# Altium schematic sheet S7CAS-PLEIADES-CARTE-MERE_P20_FPGA-Decoupling.SchDoc
size Tabloid; SheetNumber: 11; SheetTotal: 20; Sheet_Name: FPGA Decoupling; Size: 11x17
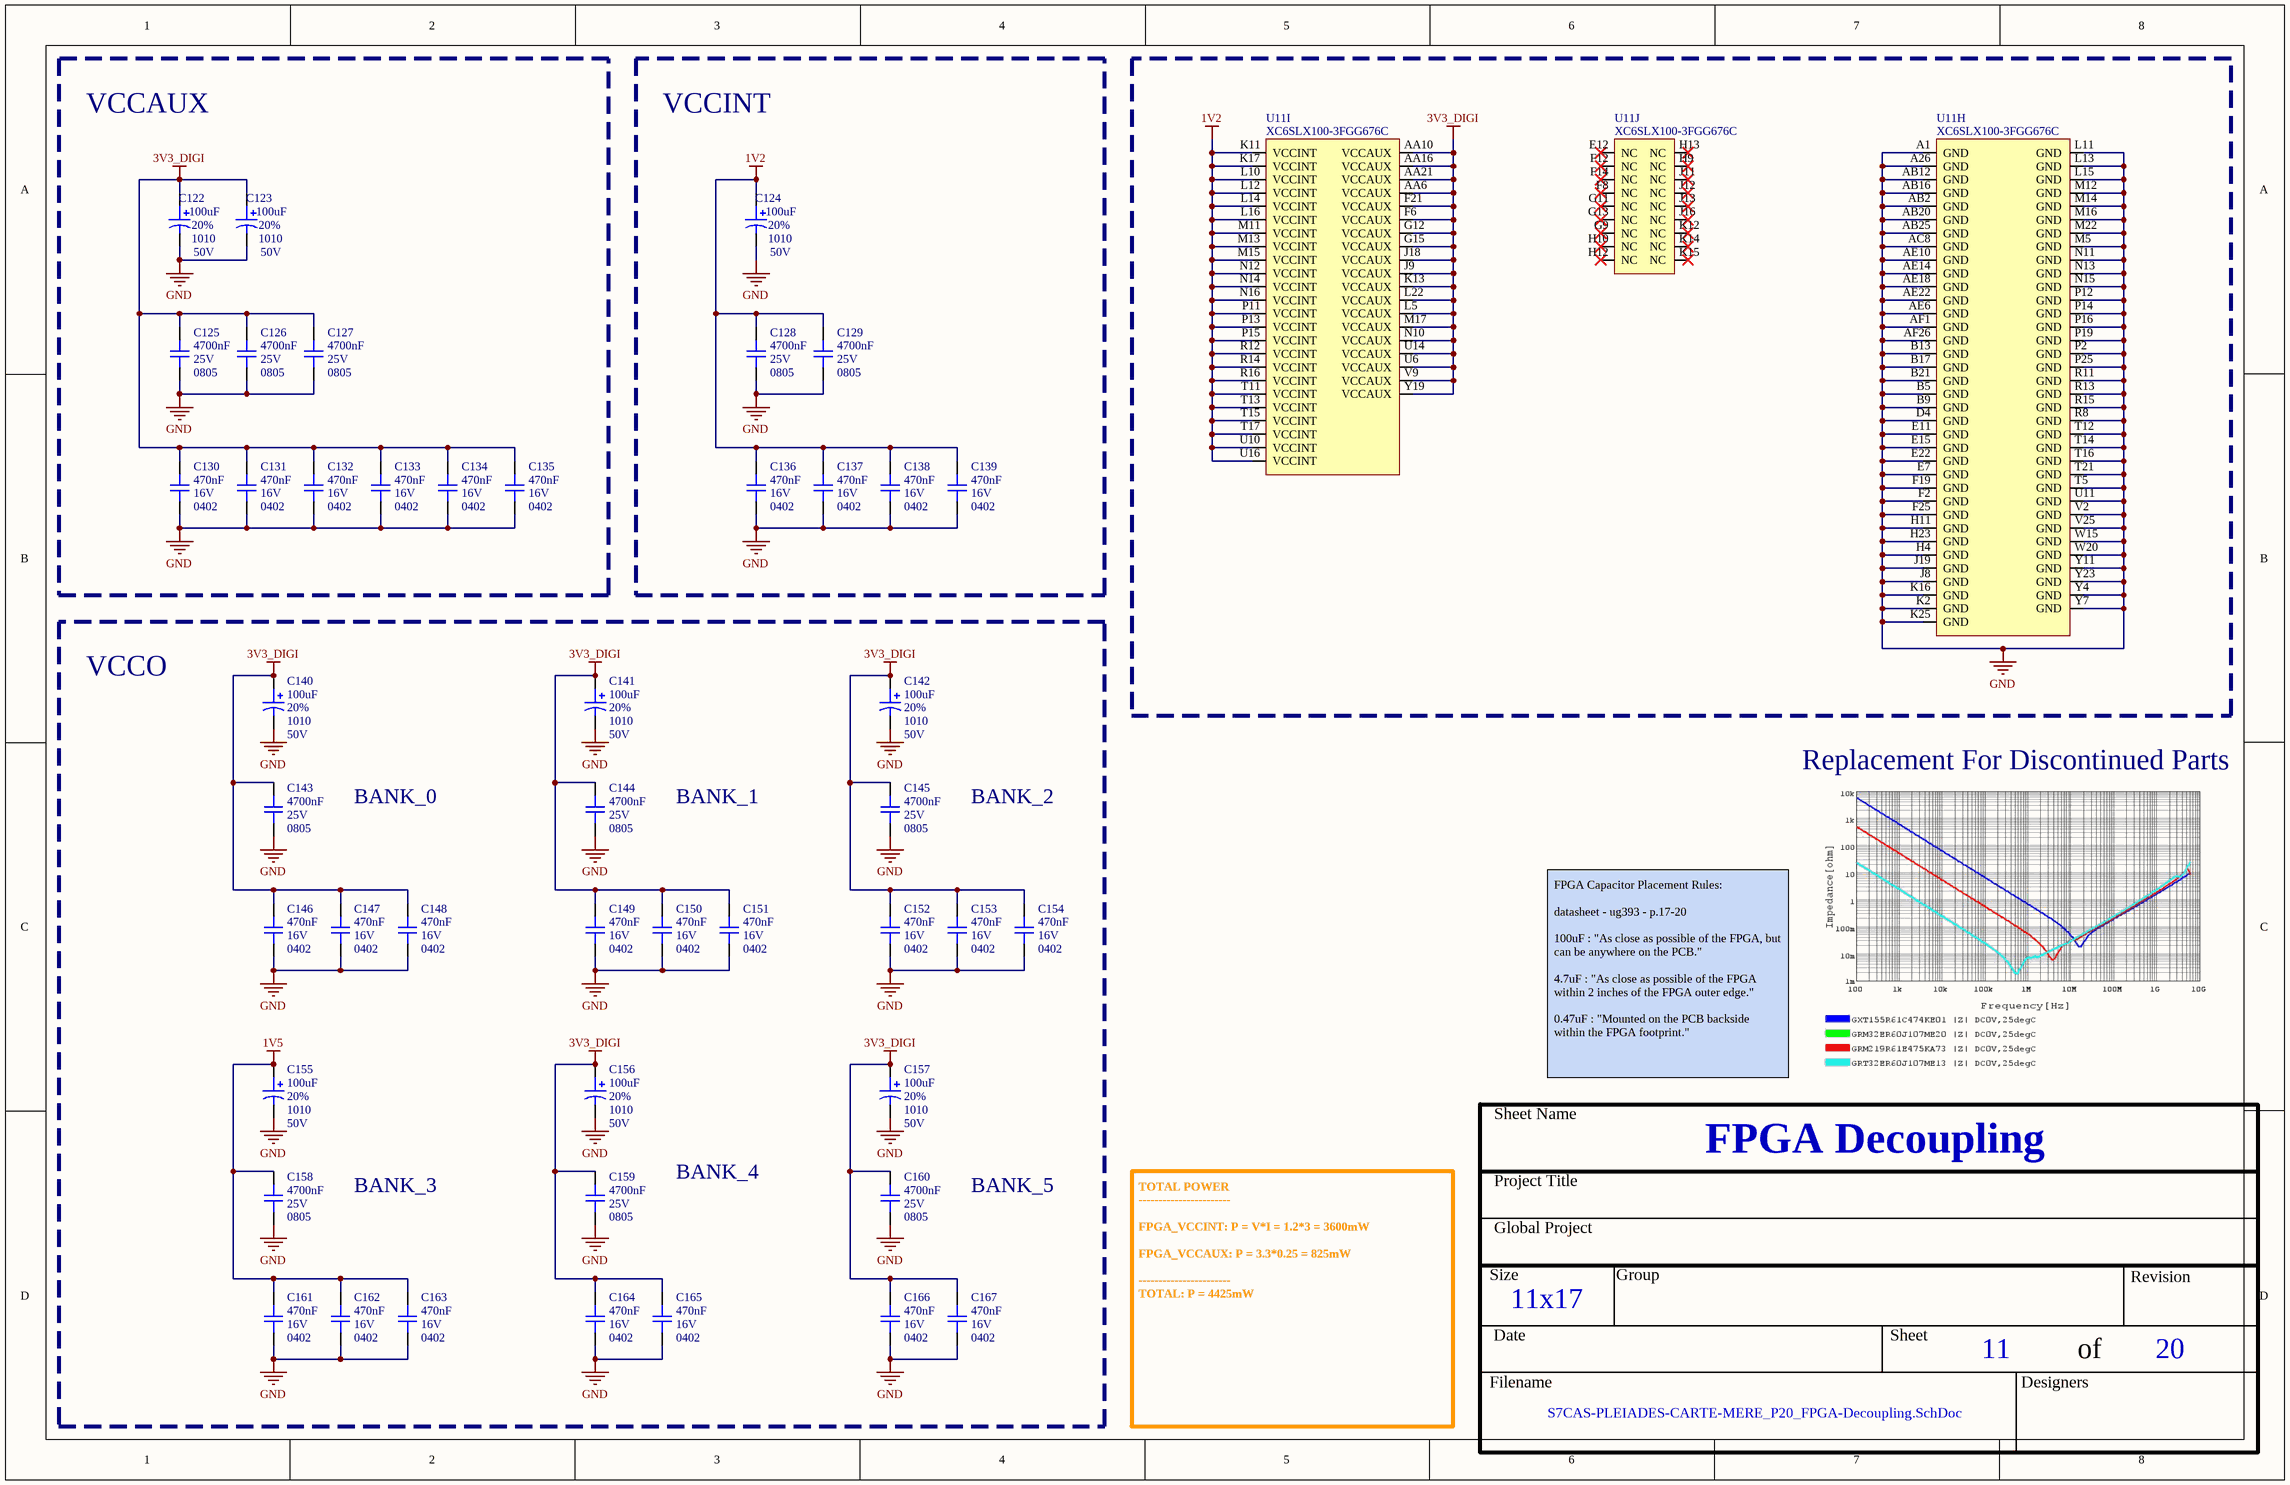
[diagram p0: S7CAS-PLEIADES-CARTE-MERE_P20_FPGA-Decoupling.SchDoc]

## Parts
C122  value 100uF  Voltage: 50V  Package: 1010  Precision: 20%  [CAP_ALU_1010_vishay]  (hidden comment: MAL215099101E3)
C123  value 100uF  Voltage: 50V  Package: 1010  Precision: 20%  [CAP_ALU_1010_vishay]  (hidden comment: MAL215099101E3)
C124  value 100uF  Voltage: 50V  Package: 1010  Precision: 20%  [CAP_ALU_1010_vishay]  (hidden comment: MAL215099101E3)
C125  value 4700nF  Voltage: 25V  Package: 0805  [CAP_0805]  (hidden comment: CAP - 0805)
C126  value 4700nF  Voltage: 25V  Package: 0805  [CAP_0805]  (hidden comment: CAP - 0805)
C127  value 4700nF  Voltage: 25V  Package: 0805  [CAP_0805]  (hidden comment: CAP - 0805)
C128  value 4700nF  Voltage: 25V  Package: 0805  [CAP_0805]  (hidden comment: CAP - 0805)
C129  value 4700nF  Voltage: 25V  Package: 0805  [CAP_0805]  (hidden comment: CAP - 0805)
C130  value 470nF  Voltage: 16V  Package: 0402  [CAP_0402]  (hidden comment: CAP - 0402)
C131  value 470nF  Voltage: 16V  Package: 0402  [CAP_0402]  (hidden comment: CAP - 0402)
C132  value 470nF  Voltage: 16V  Package: 0402  [CAP_0402]  (hidden comment: CAP - 0402)
C133  value 470nF  Voltage: 16V  Package: 0402  [CAP_0402]  (hidden comment: CAP - 0402)
C134  value 470nF  Voltage: 16V  Package: 0402  [CAP_0402]  (hidden comment: CAP - 0402)
C135  value 470nF  Voltage: 16V  Package: 0402  [CAP_0402]  (hidden comment: CAP - 0402)
C136  value 470nF  Voltage: 16V  Package: 0402  [CAP_0402]  (hidden comment: CAP - 0402)
C137  value 470nF  Voltage: 16V  Package: 0402  [CAP_0402]  (hidden comment: CAP - 0402)
C138  value 470nF  Voltage: 16V  Package: 0402  [CAP_0402]  (hidden comment: CAP - 0402)
C139  value 470nF  Voltage: 16V  Package: 0402  [CAP_0402]  (hidden comment: CAP - 0402)
C140  value 100uF  Voltage: 50V  Package: 1010  Precision: 20%  [CAP_ALU_1010_vishay]  (hidden comment: MAL215099101E3)
C141  value 100uF  Voltage: 50V  Package: 1010  Precision: 20%  [CAP_ALU_1010_vishay]  (hidden comment: MAL215099101E3)
C142  value 100uF  Voltage: 50V  Package: 1010  Precision: 20%  [CAP_ALU_1010_vishay]  (hidden comment: MAL215099101E3)
C143  value 4700nF  Voltage: 25V  Package: 0805  [CAP_0805]  (hidden comment: CAP - 0805)
C144  value 4700nF  Voltage: 25V  Package: 0805  [CAP_0805]  (hidden comment: CAP - 0805)
C145  value 4700nF  Voltage: 25V  Package: 0805  [CAP_0805]  (hidden comment: CAP - 0805)
C146  value 470nF  Voltage: 16V  Package: 0402  [CAP_0402]  (hidden comment: CAP - 0402)
C147  value 470nF  Voltage: 16V  Package: 0402  [CAP_0402]  (hidden comment: CAP - 0402)
C148  value 470nF  Voltage: 16V  Package: 0402  [CAP_0402]  (hidden comment: CAP - 0402)
C149  value 470nF  Voltage: 16V  Package: 0402  [CAP_0402]  (hidden comment: CAP - 0402)
C150  value 470nF  Voltage: 16V  Package: 0402  [CAP_0402]  (hidden comment: CAP - 0402)
C151  value 470nF  Voltage: 16V  Package: 0402  [CAP_0402]  (hidden comment: CAP - 0402)
C152  value 470nF  Voltage: 16V  Package: 0402  [CAP_0402]  (hidden comment: CAP - 0402)
C153  value 470nF  Voltage: 16V  Package: 0402  [CAP_0402]  (hidden comment: CAP - 0402)
C154  value 470nF  Voltage: 16V  Package: 0402  [CAP_0402]  (hidden comment: CAP - 0402)
C155  value 100uF  Voltage: 50V  Package: 1010  Precision: 20%  [CAP_ALU_1010_vishay]  (hidden comment: MAL215099101E3)
C156  value 100uF  Voltage: 50V  Package: 1010  Precision: 20%  [CAP_ALU_1010_vishay]  (hidden comment: MAL215099101E3)
C157  value 100uF  Voltage: 50V  Package: 1010  Precision: 20%  [CAP_ALU_1010_vishay]  (hidden comment: MAL215099101E3)
C158  value 4700nF  Voltage: 25V  Package: 0805  [CAP_0805]  (hidden comment: CAP - 0805)
C159  value 4700nF  Voltage: 25V  Package: 0805  [CAP_0805]  (hidden comment: CAP - 0805)
C160  value 4700nF  Voltage: 25V  Package: 0805  [CAP_0805]  (hidden comment: CAP - 0805)
C161  value 470nF  Voltage: 16V  Package: 0402  [CAP_0402]  (hidden comment: CAP - 0402)
C162  value 470nF  Voltage: 16V  Package: 0402  [CAP_0402]  (hidden comment: CAP - 0402)
C163  value 470nF  Voltage: 16V  Package: 0402  [CAP_0402]  (hidden comment: CAP - 0402)
C164  value 470nF  Voltage: 16V  Package: 0402  [CAP_0402]  (hidden comment: CAP - 0402)
C165  value 470nF  Voltage: 16V  Package: 0402  [CAP_0402]  (hidden comment: CAP - 0402)
C166  value 470nF  Voltage: 16V  Package: 0402  [CAP_0402]  (hidden comment: CAP - 0402)
C167  value 470nF  Voltage: 16V  Package: 0402  [CAP_0402]  (hidden comment: CAP - 0402)
U11  XC6SLX100-3FGG676C  [FPGA_XILINX_FGG676]  (parts H,I,J of 10)

## Blocks framed on the sheet
VCCAUX: C122 C123 C125-C127 C130-C135
VCCINT: C124 C128 C129 C136-C139
VCCO: C140-C167

## Nets
1V2: C124.1 C128.2 C129.2 C136.2 C137.2 C138.2 C139.2 U11.K11(VCCINT) U11.K17(VCCINT) U11.L10(VCCINT) U11.L12(VCCINT) U11.L14(VCCINT) U11.L16(VCCINT) U11.M11(VCCINT) U11.M13(VCCINT) U11.M15(VCCINT) U11.N12(VCCINT) U11.N14(VCCINT) U11.N16(VCCINT) U11.P11(VCCINT) U11.P13(VCCINT) U11.P15(VCCINT) U11.R12(VCCINT) U11.R14(VCCINT) U11.R16(VCCINT) U11.T11(VCCINT) U11.T13(VCCINT) U11.T15(VCCINT) U11.T17(VCCINT) U11.U10(VCCINT) U11.U16(VCCINT)
1V5: C155.1 C158.2 C161.2 C162.2 C163.2
3V3_DIGI: C122.1 C123.1 C125.2 C126.2 C127.2 C130.2 C131.2 C132.2 C133.2 C134.2 C135.2 C140.1 C141.1 C142.1 C143.2 C144.2 C145.2 C146.2 C147.2 C148.2 C149.2 C150.2 C151.2 C152.2 C153.2 C154.2 C156.1 C157.1 C159.2 C160.2 C164.2 C165.2 C166.2 C167.2 U11.AA6(VCCAUX) U11.AA10(VCCAUX) U11.AA16(VCCAUX) U11.AA21(VCCAUX) U11.F6(VCCAUX) U11.F21(VCCAUX) U11.G12(VCCAUX) U11.G15(VCCAUX) U11.J9(VCCAUX) U11.J18(VCCAUX) U11.K13(VCCAUX) U11.L5(VCCAUX) U11.L22(VCCAUX) U11.M17(VCCAUX) U11.N10(VCCAUX) U11.U6(VCCAUX) U11.U14(VCCAUX) U11.V9(VCCAUX) U11.Y19(VCCAUX)
GND: C122.2 C123.2 C124.2 C125.1 C126.1 C127.1 C128.1 C129.1 C130.1 C131.1 C132.1 C133.1 C134.1 C135.1 C136.1 C137.1 C138.1 C139.1 C140.2 C141.2 C142.2 C143.1 C144.1 C145.1 C146.1 C147.1 C148.1 C149.1 C150.1 C151.1 C152.1 C153.1 C154.1 C155.2 C156.2 C157.2 C158.1 C159.1 C160.1 C161.1 C162.1 C163.1 C164.1 C165.1 C166.1 C167.1 U11.A1(GND) U11.A26(GND) U11.AB2(GND) U11.AB12(GND) U11.AB16(GND) U11.AB20(GND) U11.AB25(GND) U11.AC8(GND) U11.AE6(GND) U11.AE10(GND) U11.AE14(GND) U11.AE18(GND) U11.AE22(GND) U11.AF1(GND) U11.AF26(GND) U11.B5(GND) U11.B9(GND) U11.B13(GND) U11.B17(GND) U11.B21(GND) U11.D4(GND) U11.E7(GND) U11.E11(GND) U11.E15(GND) U11.E22(GND) U11.F2(GND) U11.F19(GND) U11.F25(GND) U11.H4(GND) U11.H11(GND) U11.H23(GND) U11.J8(GND) U11.J19(GND) U11.K2(GND) U11.K16(GND) U11.K25(GND) U11.L11(GND) U11.L13(GND) U11.L15(GND) U11.M5(GND) U11.M12(GND) U11.M14(GND) U11.M16(GND) U11.M22(GND) U11.N11(GND) U11.N13(GND) U11.N15(GND) U11.P2(GND) U11.P12(GND) U11.P14(GND) U11.P16(GND) U11.P19(GND) U11.P25(GND) U11.R8(GND) U11.R11(GND) U11.R13(GND) U11.R15(GND) U11.T5(GND) U11.T12(GND) U11.T14(GND) U11.T16(GND) U11.T21(GND) U11.U11(GND) U11.V2(GND) U11.V25(GND) U11.W15(GND) U11.W20(GND) U11.Y4(GND) U11.Y7(GND) U11.Y11(GND) U11.Y23(GND)

Not connected (* = marked no-connect by the designer): U11 E12(NC)* F8(NC)* F12(NC)* F14(NC)* G9(NC)* G11(NC)* G13(NC)* H9(NC)* H10(NC)* H12(NC)* H13(NC)* J11(NC)* J12(NC)* J13(NC)* J16(NC)* K12(NC)* K14(NC)* K15(NC)*

## Notes on the sheet
- Replacement For Discontinued Parts
- BANK_0
- BANK_1
- BANK_2
- FPGA Capacitor Placement Rules:
  datasheet - ug393 - p.17-20
  100uF : "As close as possible of the FPGA, but can be anywhere on the PCB."
  4.7uF : "As close as possible of the FPGA within 2 inches of the FPGA outer edge."
  0.47uF : "Mounted on the PCB backside within the FPGA footprint."
- BANK_3
- BANK_4
- BANK_5
- TOTAL POWER
  -----------------------
  FPGA_VCCINT: P = V*I = 1.2*3 = 3600mW
  FPGA_VCCAUX: P = 3.3*0.25 = 825mW
  -----------------------
  TOTAL: P = 4425mW
- Sheet Name
- Project Title
- Global Project
- Size
- Group
- Revision
- Date
- Sheet
- of
- Filename
- Designers

## Library data of the parts
C122-C124 C140-C142 C155-C157 = CAP_ALU_MAL215099101E3: CAP - ALU 100uF 20% 50V - 1010; Current: 490mA; Mfg: Vishay Dale; Mfg Part Number: MAL215099101E3; HelpURL: http://www.vishay.com/docs/28395/150crz.pdf; CreatedBy: Jonathan Bouchard; Temperature: -55°C to 125°C; Power: *; Supplier 1: Digikey; Supplier Part Number 1: 4399PHDKR-ND
C125-C129 C143-C145 C158-C160 = CAP - 0805: Mfg Part Number: GRM219R61E475KA73; Precision: 10%; Current: *; CreatedBy: Jonathan Bouchard; Power: *
C130-C139 C146-C154 C161-C167 = CAP - 0402: Mfg Part Number: GXT155R61C474KE01; Precision: 10%; Current: *; CreatedBy: Jonathan Bouchard; Power: *
U11 = FPGA_XC6SLX100-3FGG676C: FPGA - XILINX SPARTAN 6 480 I/O - BGA-676; Voltage: 1.14 V ~ 1.26 V; Current: *; Power: *; Mfg: Xilinx; Mfg Part Number: XC6SLX100-3FGG676C; HelpURL: https://www.xilinx.com/support/documentation/data_sheets/ds162.pdf; CreatedBy: Jonathan Bouchard; Temperature: 0°C ~ 85°C (TJ); Value: *; Precision: *; Package: BGA-676; Supplier 1: Digikey; Supplier Part Number 1: 122-1760-ND